# EAGLE board ADC3_FPGA_BGA (EAGLE 9.6.2)
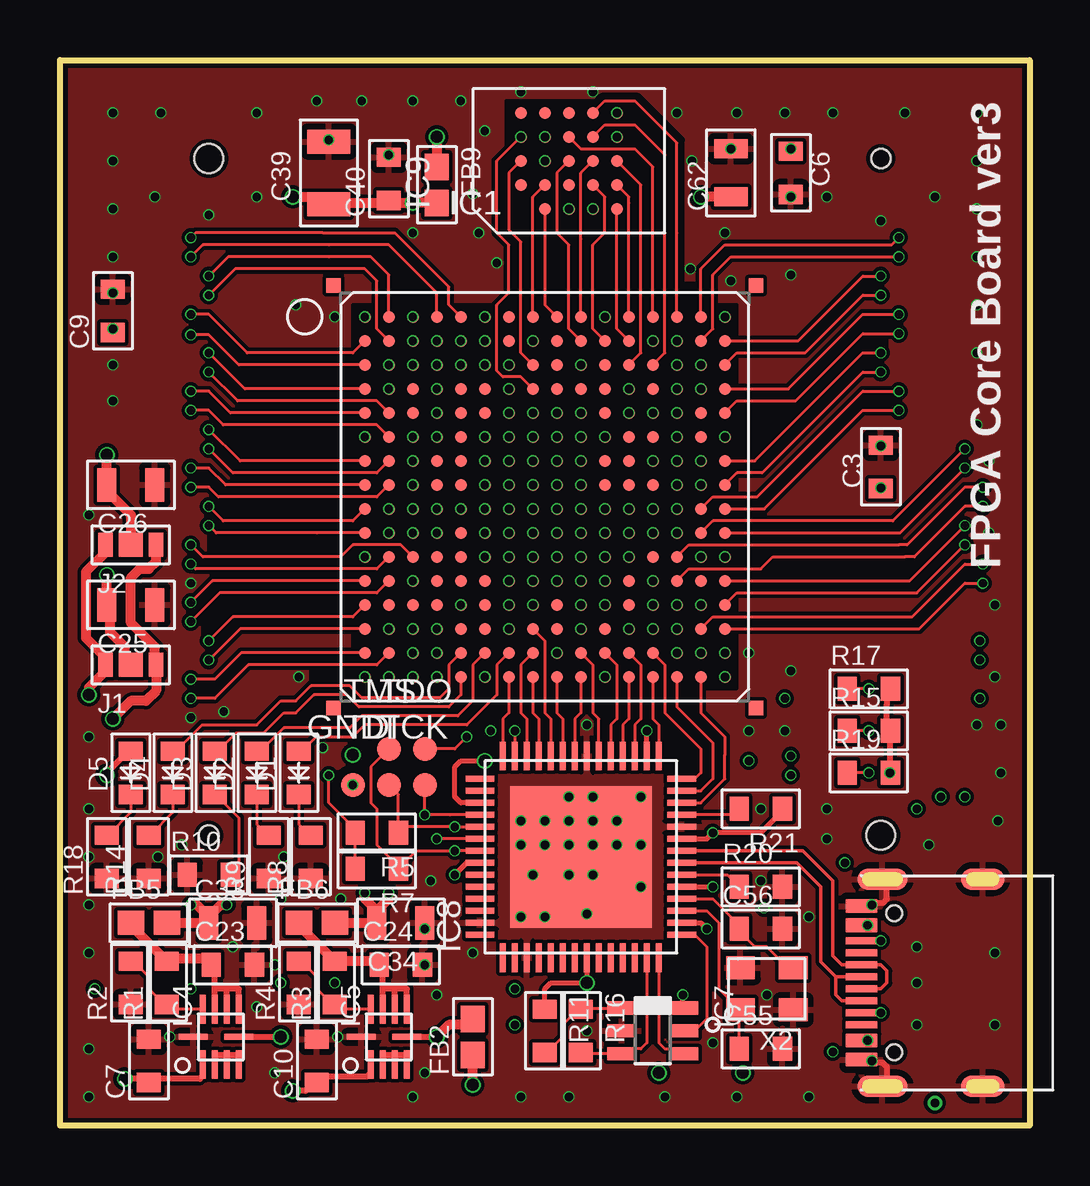
[diagram p2: board, top side]
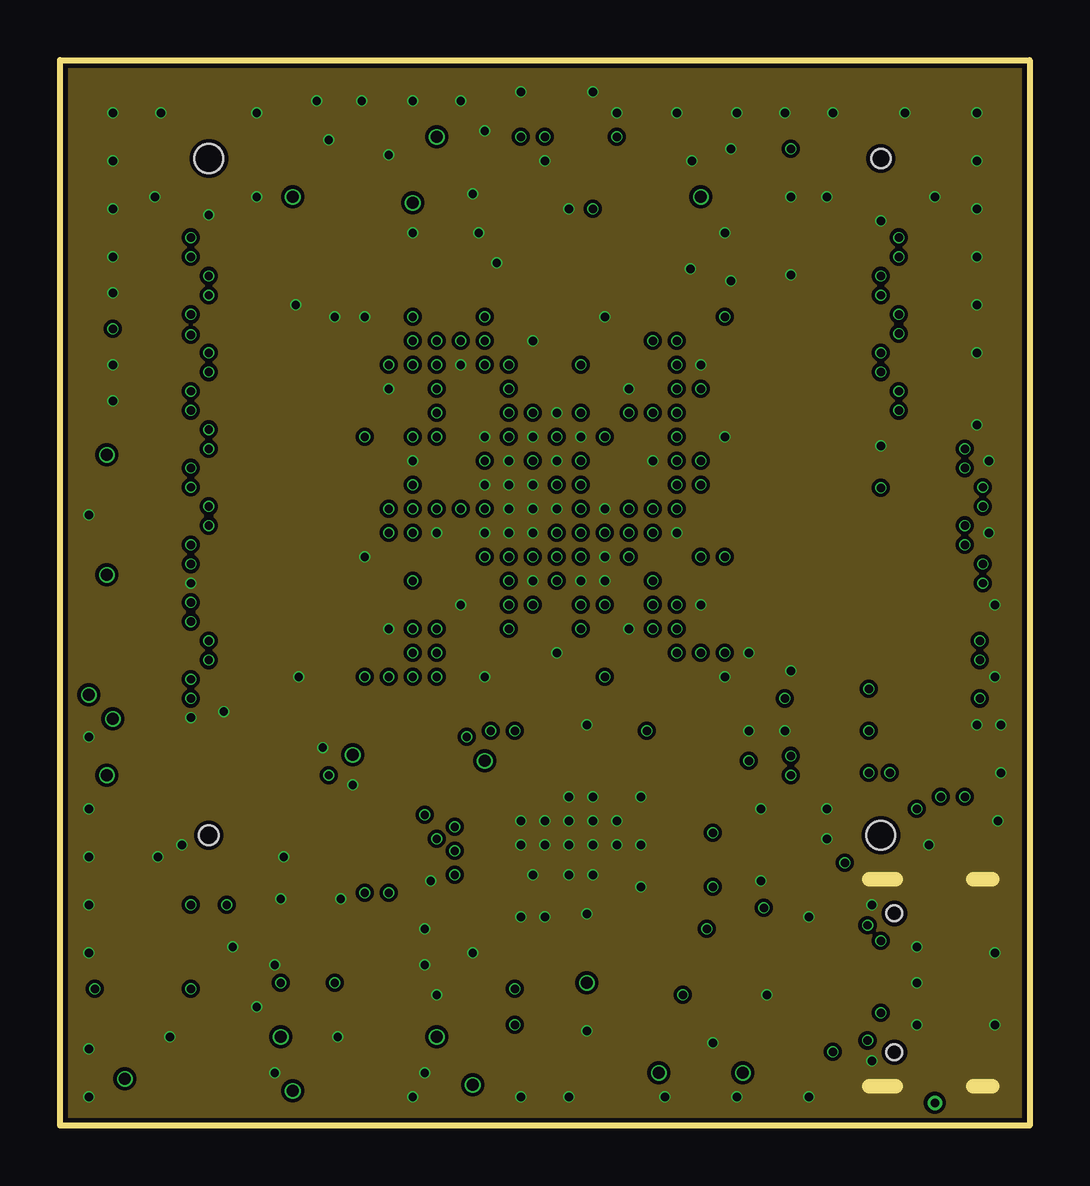
[diagram p3: board, inner layer Route2]
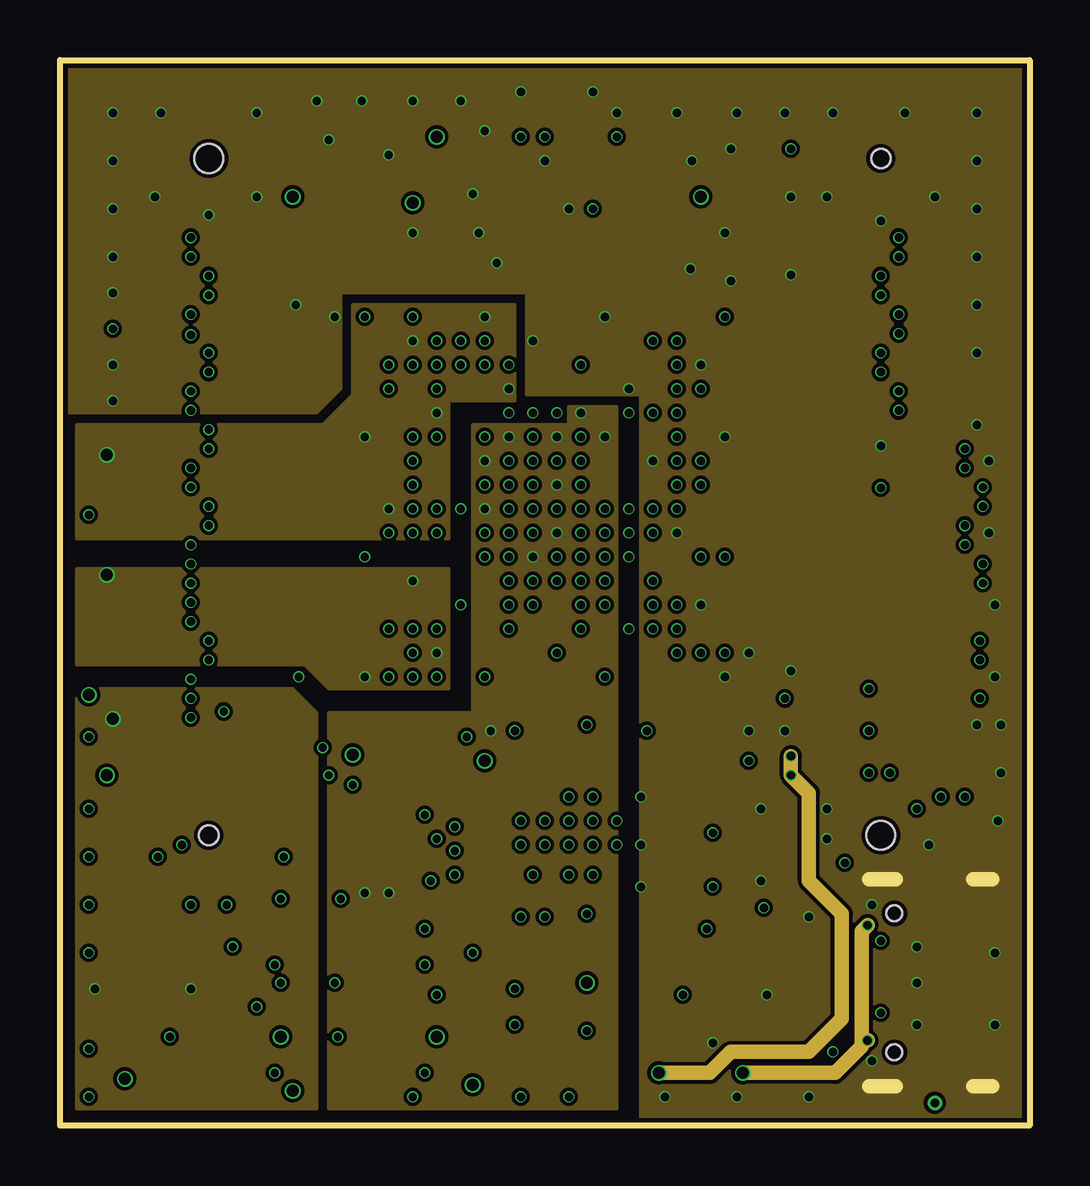
[diagram p4: board, inner layer Route3]
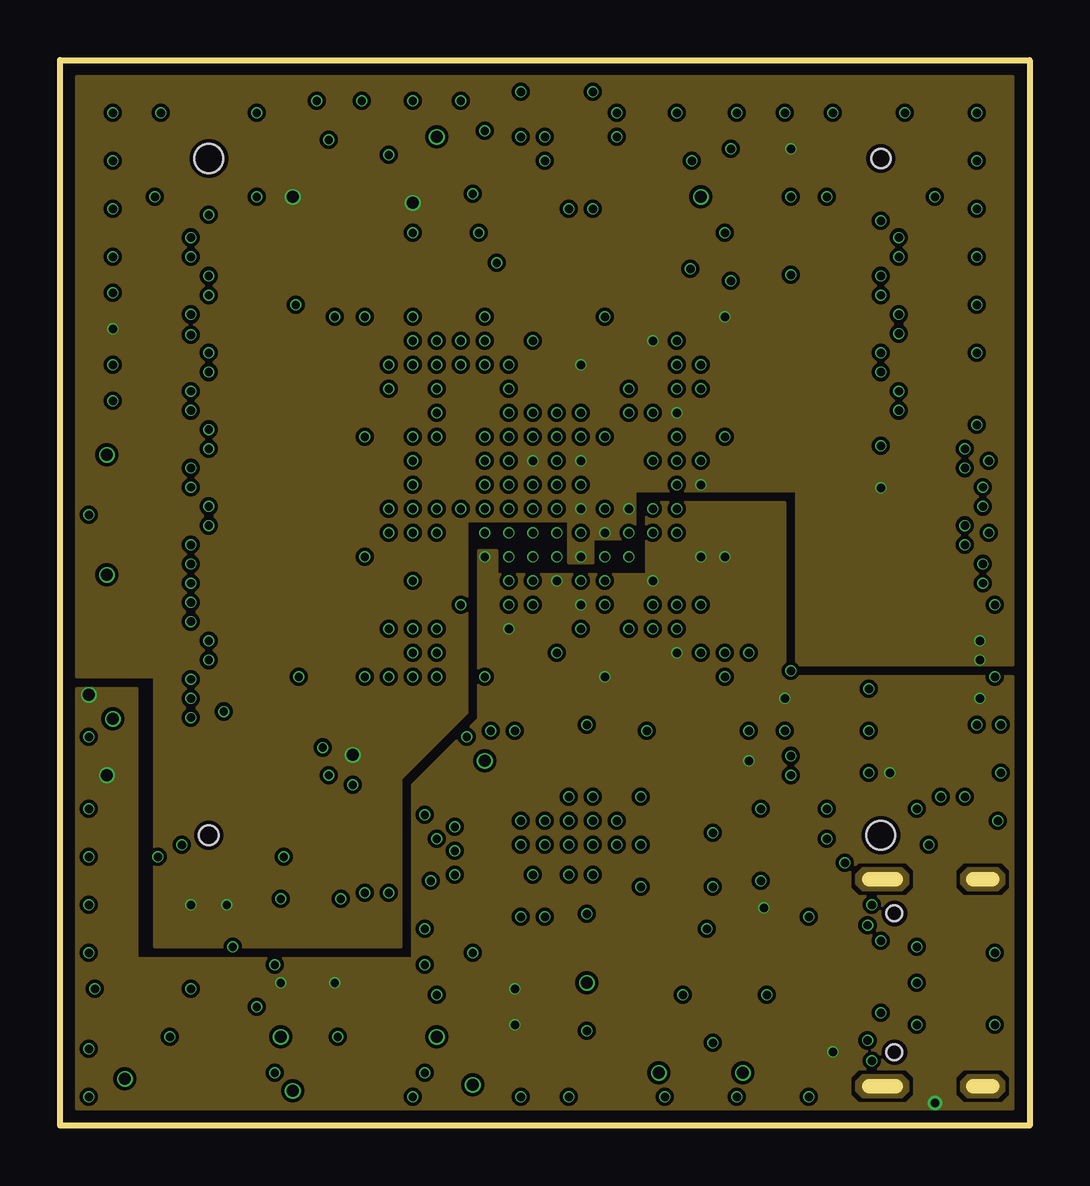
[diagram p5: board, inner layer Route14]
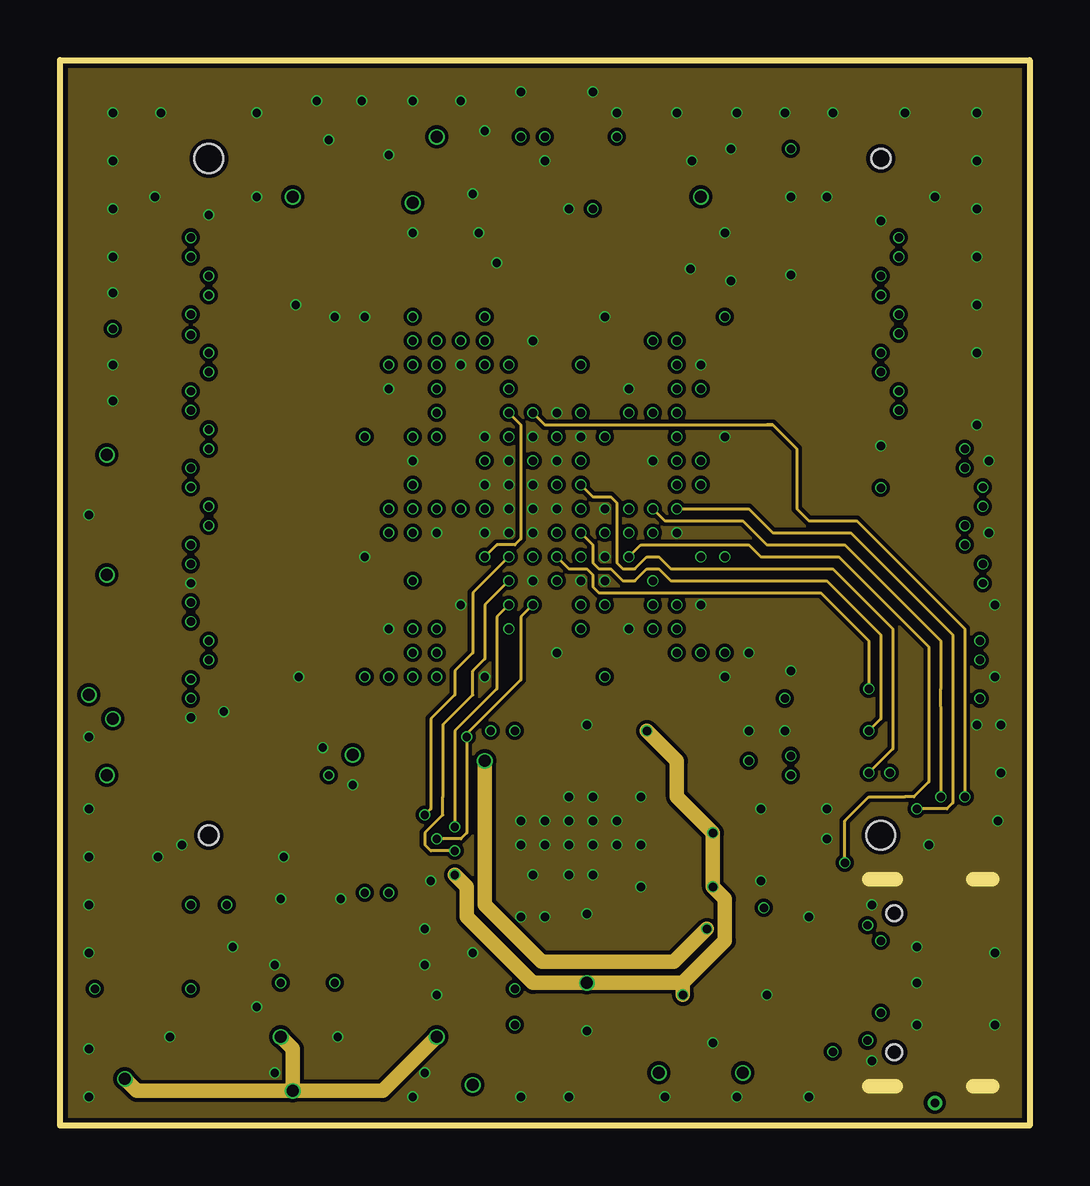
[diagram p6: board, inner layer Route15]
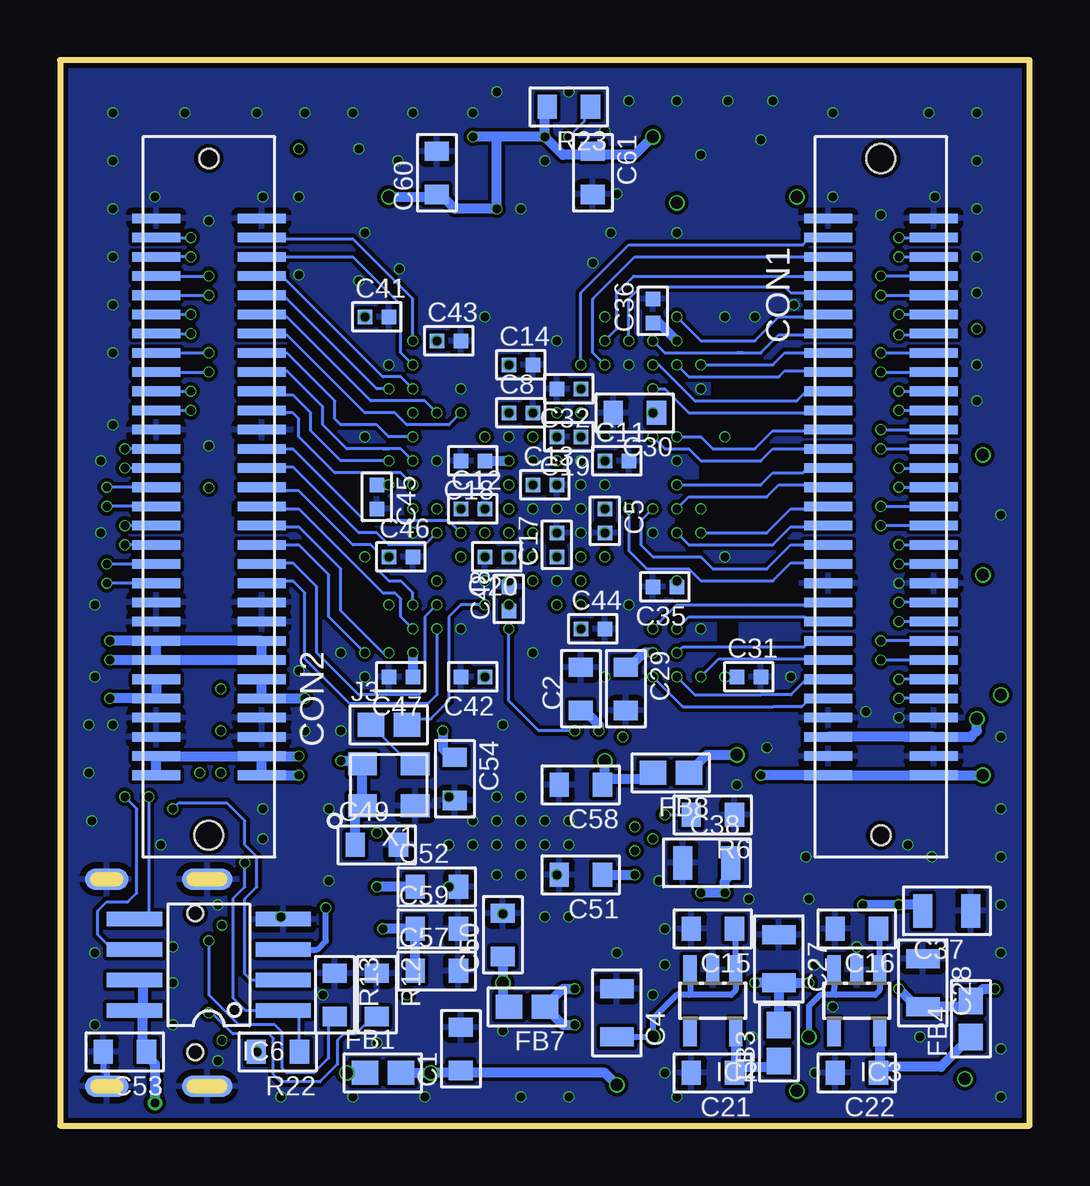
[diagram p7: board, bottom side, seen from below]

Size 40.4 x 44.4 mm. Coordinates in mm from the lower left corner, seen from the top.
Outline: 0,44.4 40.4,44.4 40.4,0 0,0 0,44.4
Copper layers (1+2*3+14*15+16): Top 0.035mm / dielectric 0.2mm / Route2 0.0175mm / dielectric 1.065mm / Route3 0.035mm / dielectric 0.2mm / Route14 0.035mm / dielectric 0.15mm / Route15 0.0175mm / dielectric 0.2mm / Bottom 0.035mm
Design rules "JLCPCB_4layer_limit *": minimum track width 5mil, minimum drill 0.3mm, track to track 5mil, track to pad 5mil, pad to pad 5mil, via to via 5mil, smd to smd 0mil, copper to edge 0.2mm, drill to drill 10mil, minimum pad ring 0.13mm, minimum via ring 0.05mm, stop-mask expansion 2mil, vias tented up to drill 1mm, thermal gap 10mil
tRestrict: area 11.6,13.6 to 12.8,14.8; 5 lines

## Footprints (pad centres in the part's own frame; a part is rotated, then mirrored left to right if it is on the bottom)
1608C = smd 0.8 x 1: 1 -0.9,0; 2 0.9,0
2012 = smd 0.8 x 1.4: 1 -1,0; 2 1,0
1005 = smd 0.6 x 0.6: 1 -0.5,0; 2 0.5,0
3216 = smd 1 x 1.8: 1 -1.3,0; 2 1.3,0
MEZZANINE_0.8MM_2X30 = smd 0.4 x 2: 1 -11.6,-2.2; 2 -11.6,2.2; 3 -10.8,-2.2; 4 -10.8,2.2; 5 -10,-2.2; 6 -10,2.2; 7 -9.2,-2.2; 8 -9.2,2.2; 9 -8.4,-2.2; 10 -8.4,2.2; 11 -7.6,-2.2; 12 -7.6,2.2; 13 -6.8,-2.2; 14 -6.8,2.2; 15 -6,-2.2; 16 -6,2.2; 17 -5.2,-2.2; 18 -5.2,2.2; 19 -4.4,-2.2; 20 -4.4,2.2; 21 -3.6,-2.2; 22 -3.6,2.2; 23 -2.8,-2.2; 24 -2.8,2.2; 25 -2,-2.2; 26 -2,2.2; 27 -1.2,-2.2; 28 -1.2,2.2; 29 -0.4,-2.2; 30 -0.4,2.2; 31 0.4,-2.2; 32 0.4,2.2; 33 1.2,-2.2; 34 1.2,2.2; 35 2,-2.2; 36 2,2.2; 37 2.8,-2.2; 38 2.8,2.2; 39 3.6,-2.2; 40 3.6,2.2; 41 4.4,-2.2; 42 4.4,2.2; 43 5.2,-2.2; 44 5.2,2.2; 45 6,-2.2; 46 6,2.2; 47 6.8,-2.2; 48 6.8,2.2; 49 7.6,-2.2; 50 7.6,2.2; 51 8.4,-2.2; 52 8.4,2.2; 53 9.2,-2.2; 54 9.2,2.2; 55 10,-2.2; 56 10,2.2; 57 10.8,-2.2; 58 10.8,2.2; 59 11.6,-2.2; 60 11.6,2.2 | hole 1.2: -14.1,0 | hole 0.8: 14.1,0
5077CR-16-SMC2-BK-TR = smd 0.6 x 1.34: A1,B12:GND -3.2,0.3; A4,B9:VBUS -2.4,0.3; B1,A12:GND 3.2,0.3; B4,A9:VBUS 2.4,0.3 | smd 0.3 x 1.34: A5:CC1 -1.25,0.3; A6:DP1 -0.25,0.3; A7:DN1 0.25,0.3; A8:SBU1 1.25,0.3; B5:CC2 1.75,0.3; B6:DP2 0.75,0.3; B7:DN2 -0.75,0.3; B8:SBU2 -1.75,0.3 | smd 0.9 x 2.1: SHILED1 -4.32,-0.57; SHILED2 4.32,-0.57 | smd 0.9 x 1.8: SHILED3 -4.32,-4.75; SHILED4 4.32,-4.75 | smd 0.9 x 2.1 bottom: SHILED5 -4.32,-0.57; SHILED7 4.32,-0.57 | smd 0.9 x 1.8 bottom: SHILED6 -4.32,-4.75; SHILED8 4.32,-4.75 | hole 0.65: -2.89,-1.07; 2.89,-1.07
D1608 = smd 0.8 x 1: A 0.9,0; K -0.9,0
1608-J = smd 1.1 x 1: 1 -0.75,0; 2 0.75,0
FTG256 = smd 0.5 x 0.5: A1 -7.5,7.5; A2 -6.5,7.5; A3 -5.5,7.5; A4 -4.5,7.5; A5 -3.5,7.5; A6 -2.5,7.5; A7 -1.5,7.5; A8 -0.5,7.5; A9 0.5,7.5; A10 1.5,7.5; A11 2.5,7.5; A12 3.5,7.5; A13 4.5,7.5; A14 5.5,7.5; A15 6.5,7.5; A16 7.5,7.5; B1 -7.5,6.5; B2 -6.5,6.5; B3 -5.5,6.5; B4 -4.5,6.5; B5 -3.5,6.5; B6 -2.5,6.5; B7 -1.5,6.5; B8 -0.5,6.5; B9 0.5,6.5; B10 1.5,6.5; B11 2.5,6.5; B12 3.5,6.5; B13 4.5,6.5; B14 5.5,6.5; B15 6.5,6.5; B16 7.5,6.5; C1 -7.5,5.5; C2 -6.5,5.5; C3 -5.5,5.5; C4 -4.5,5.5; C5 -3.5,5.5; C6 -2.5,5.5; C7 -1.5,5.5; C8 -0.5,5.5; C9 0.5,5.5; C10 1.5,5.5; C11 2.5,5.5; C12 3.5,5.5; C13 4.5,5.5; C14 5.5,5.5; C15 6.5,5.5; C16 7.5,5.5; D1 -7.5,4.5; D2 -6.5,4.5; D3 -5.5,4.5; D4 -4.5,4.5; D5 -3.5,4.5; D6 -2.5,4.5; D7 -1.5,4.5; D8 -0.5,4.5; D9 0.5,4.5; D10 1.5,4.5; D11 2.5,4.5; D12 3.5,4.5; D13 4.5,4.5; D14 5.5,4.5; D15 6.5,4.5; D16 7.5,4.5; E1 -7.5,3.5; E2 -6.5,3.5; E3 -5.5,3.5; E4 -4.5,3.5; E5 -3.5,3.5; E6 -2.5,3.5; E7 -1.5,3.5; E8 -0.5,3.5; E9 0.5,3.5; E10 1.5,3.5; E11 2.5,3.5; E12 3.5,3.5; E13 4.5,3.5; E14 5.5,3.5; E15 6.5,3.5; E16 7.5,3.5; F1 -7.5,2.5; F2 -6.5,2.5; F3 -5.5,2.5; F4 -4.5,2.5; F5 -3.5,2.5; F6 -2.5,2.5; F7 -1.5,2.5; F8 -0.5,2.5; F9 0.5,2.5; F10 1.5,2.5; F11 2.5,2.5; F12 3.5,2.5; F13 4.5,2.5; F14 5.5,2.5; F15 6.5,2.5; F16 7.5,2.5; G1 -7.5,1.5; G2 -6.5,1.5; G3 -5.5,1.5; G4 -4.5,1.5; G5 -3.5,1.5; G6 -2.5,1.5; G7 -1.5,1.5; G8 -0.5,1.5; G9 0.5,1.5; G10 1.5,1.5; G11 2.5,1.5; G12 3.5,1.5; G13 4.5,1.5; G14 5.5,1.5; G15 6.5,1.5; G16 7.5,1.5; H1 -7.5,0.5; H2 -6.5,0.5; H3 -5.5,0.5; H4 -4.5,0.5; H5 -3.5,0.5; H6 -2.5,0.5; H7 -1.5,0.5; H8 -0.5,0.5; H9 0.5,0.5; H10 1.5,0.5; H11 2.5,0.5; H12 3.5,0.5; H13 4.5,0.5; H14 5.5,0.5; H15 6.5,0.5; H16 7.5,0.5; J1 -7.5,-0.5; J2 -6.5,-0.5; J3 -5.5,-0.5; J4 -4.5,-0.5; J5 -3.5,-0.5; J6 -2.5,-0.5; J7 -1.5,-0.5; J8 -0.5,-0.5; J9 0.5,-0.5; J10 1.5,-0.5; J11 2.5,-0.5; J12 3.5,-0.5; J13 4.5,-0.5; J14 5.5,-0.5; J15 6.5,-0.5; J16 7.5,-0.5; K1 -7.5,-1.5; K2 -6.5,-1.5; K3 -5.5,-1.5; K4 -4.5,-1.5; K5 -3.5,-1.5; K6 -2.5,-1.5; K7 -1.5,-1.5; K8 -0.5,-1.5; K9 0.5,-1.5; K10 1.5,-1.5; K11 2.5,-1.5; K12 3.5,-1.5; K13 4.5,-1.5; K14 5.5,-1.5; K15 6.5,-1.5; K16 7.5,-1.5; L1 -7.5,-2.5; L2 -6.5,-2.5; L3 -5.5,-2.5; L4 -4.5,-2.5; L5 -3.5,-2.5; L6 -2.5,-2.5; L7 -1.5,-2.5; L8 -0.5,-2.5; L9 0.5,-2.5; L10 1.5,-2.5; L11 2.5,-2.5; L12 3.5,-2.5; L13 4.5,-2.5; L14 5.5,-2.5; L15 6.5,-2.5; L16 7.5,-2.5; M1 -7.5,-3.5; M2 -6.5,-3.5; M3 -5.5,-3.5; M4 -4.5,-3.5; M5 -3.5,-3.5; M6 -2.5,-3.5; M7 -1.5,-3.5; M8 -0.5,-3.5; M9 0.5,-3.5; M10 1.5,-3.5; M11 2.5,-3.5; M12 3.5,-3.5; M13 4.5,-3.5; M14 5.5,-3.5; M15 6.5,-3.5; M16 7.5,-3.5; N1 -7.5,-4.5; N2 -6.5,-4.5; N3 -5.5,-4.5; N4 -4.5,-4.5; N5 -3.5,-4.5; N6 -2.5,-4.5; N7 -1.5,-4.5; N8 -0.5,-4.5; N9 0.5,-4.5; N10 1.5,-4.5; N11 2.5,-4.5; N12 3.5,-4.5; N13 4.5,-4.5; N14 5.5,-4.5; N15 6.5,-4.5; N16 7.5,-4.5; P1 -7.5,-5.5; P2 -6.5,-5.5; P3 -5.5,-5.5; P4 -4.5,-5.5; P5 -3.5,-5.5; P6 -2.5,-5.5; P7 -1.5,-5.5; P8 -0.5,-5.5; P9 0.5,-5.5; P10 1.5,-5.5; P11 2.5,-5.5; P12 3.5,-5.5; P13 4.5,-5.5; P14 5.5,-5.5; P15 6.5,-5.5; P16 7.5,-5.5; R1 -7.5,-6.5; R2 -6.5,-6.5; R3 -5.5,-6.5; R4 -4.5,-6.5; R5 -3.5,-6.5; R6 -2.5,-6.5; R7 -1.5,-6.5; R8 -0.5,-6.5; R9 0.5,-6.5; R10 1.5,-6.5; R11 2.5,-6.5; R12 3.5,-6.5; R13 4.5,-6.5; R14 5.5,-6.5; R15 6.5,-6.5; R16 7.5,-6.5; T1 -7.5,-7.5; T2 -6.5,-7.5; T3 -5.5,-7.5; T4 -4.5,-7.5; T5 -3.5,-7.5; T6 -2.5,-7.5; T7 -1.5,-7.5; T8 -0.5,-7.5; T9 0.5,-7.5; T10 1.5,-7.5; T11 2.5,-7.5; T12 3.5,-7.5; T13 4.5,-7.5; T14 5.5,-7.5; T15 6.5,-7.5; T16 7.5,-7.5 | smd 0.6 x 0.6: GUID1 -8.8,8.8; GUID2 -8.8,-8.8; GUID3 8.8,-8.8; GUID4 8.8,8.8
SOT23-5 = smd 0.55 x 1.2: 1 -0.95,-1.3; 2 0,-1.3; 3 0.95,-1.3; 4 0.95,1.3; 5 -0.95,1.3
QFN-10 = smd 1.2 x 0.25: 1 -1.15,0.75; 2 -1.15,0.25; 3 -1.15,-0.25; 4 -1.15,-0.75; 6 1.15,-0.75; 7 1.15,-0.25; 8 1.15,0.25; 9 1.15,0.75 | smd 0.25 x 1.2: 5 0,-0.75; 10 0,1.15
SOIC-SOIJ-8 = smd 0.6 x 2.3: 1 -1.905,-3.1; 2 -0.635,-3.1; 3 0.635,-3.1; 4 1.905,-3.1; 5 1.905,3.1; 6 0.635,3.1; 7 -0.635,3.1; 8 -1.905,3.1
SOT23-6 = smd 0.55 x 1.2: 1 -0.95,-1.3; 2 0,-1.3; 3 0.95,-1.3; 4 0.95,1.3; 5 0,1.3; 6 -0.95,1.3
QFN56-HT = smd 0.25 x 1.2: 1 -3.25,-4.2; 2 -2.75,-4.2; 3 -2.25,-4.2; 4 -1.75,-4.2; 5 -1.25,-4.2; 6 -0.75,-4.2; 7 -0.25,-4.2; 8 0.25,-4.2; 9 0.75,-4.2; 10 1.25,-4.2; 11 1.75,-4.2; 12 2.25,-4.2; 13 2.75,-4.2; 14 3.25,-4.2; 29 3.25,4.2; 30 2.75,4.2; 31 2.25,4.2; 32 1.75,4.2; 33 1.25,4.2; 34 0.75,4.2; 35 0.25,4.2; 36 -0.25,4.2; 37 -0.75,4.2; 38 -1.25,4.2; 39 -1.75,4.2; 40 -2.25,4.2; 41 -2.75,4.2; 42 -3.25,4.2 | smd 1.2 x 0.25: 15 4.2,-3.25; 16 4.2,-2.75; 17 4.2,-2.25; 18 4.2,-1.75; 19 4.2,-1.25; 20 4.2,-0.75; 21 4.2,-0.25; 22 4.2,0.25; 23 4.2,0.75; 24 4.2,1.25; 25 4.2,1.75; 26 4.2,2.25; 27 4.2,2.75; 28 4.2,3.25; 43 -4.2,3.25; 44 -4.2,2.75; 45 -4.2,2.25; 46 -4.2,1.75; 47 -4.2,1.25; 48 -4.2,0.75; 49 -4.2,0.25; 50 -4.2,-0.25; 51 -4.2,-0.75; 52 -4.2,-1.25; 53 -4.2,-1.75; 54 -4.2,-2.25; 55 -4.2,-2.75; 56 -4.2,-3.25 | smd 5.9 x 5.9: HT 0,0
TFBGA24 = smd 0.5 x 0.5: A2 -1,2; A3 0,2; A4 1,2; A5 2,2; B1 -2,1; B2 -1,1; B3 0,1; B4 1,1; B5 2,1; C1 -2,0; C2 -1,0; C3 0,0; C4 1,0; C5 2,0; D1 -2,-1; D2 -1,-1; D3 0,-1; D4 1,-1; D5 2,-1; E1 -2,-2; E2 -1,-2; E3 0,-2; E4 1,-2; E5 2,-2
1608-3-J = smd 0.6 x 1: 1 -1.05,0; 3 1.05,0 | smd 1 x 1: 2 0,0
1608 = smd 0.8 x 1: 1 -0.9,0; 2 0.9,0
TESTPAD-SMALL = smd 1 x 1: 1 0,0
KC3225 = smd 1.2 x 0.95: 1 -1.1,-0.875; 2 1.1,-0.875; 3 1.1,0.875; 4 -1.1,0.875

## Placement (x,y rotation side)
C1  0.1u  [1608C]  23.7,3.2 90 bottom
C2  4.7u  [1608C]  18.7,18.2 90 bottom
C3  4.7u  [1608C]  34.2,27.45 90 top
C4  10u  [2012]  17.2,4.7 90 bottom
C5  1u  [1005]  17.7,25.2 270 bottom
C6  4.7u  [1608C]  30.45,39.7 270 top
C7  10u  [1608C]  3.7,2.7 90 top
C8  1u  [1005]  21.2,29.7 0 bottom
C9  4.7u  [1608C]  2.2,33.95 90 top
C10  10u  [1608C]  10.7,2.7 90 top
C11  1u  [1005]  17.2,27.7 0 bottom
C12  1u  [1005]  23.2,25.7 0 bottom
C13  1u  [1005]  20.2,26.7 0 bottom
C14  1u  [1005]  21.2,31.7 0 bottom
C15  0.1u  [1608C]  13.2,8.2 180 bottom
C16  0.1u  [1608C]  7.2,8.2 180 bottom
C17  1u  [1005]  19.7,24.2 90 bottom
C18  1u  [1005]  23.2,27.7 180 bottom
C19  1u  [1005]  19.2,28.7 180 bottom
C20  1u  [1005]  22.2,23.7 180 bottom
C21  10u  [1608C]  13.2,2.2 180 bottom
C22  10u  [1608C]  7.2,2.2 180 bottom
C23  10u  [1608C]  7.2,6.7 0 top
C24  10u  [1608C]  14.2,6.7 0 top
C25  47u  [2012]  2.95,21.7 0 top
C26  47u  [2012]  2.95,26.7 0 top
C27  47u  [2012]  10.45,6.95 90 bottom
C28  47u  [2012]  4.45,5.95 90 bottom
C29  4.7u  [1608C]  16.82,18.2 270 bottom
C30  4.7u  [1608C]  16.45,29.7 180 bottom
C31  1u  [1005]  11.7,18.7 0 bottom
C32  1u  [1005]  19.2,30.7 180 bottom
C33  47u  [2012]  7.2,8.45 0 top
C34  47u  [2012]  14.2,8.45 0 top
C35  1u  [1005]  15.2,22.45 180 bottom
C36  1u  [1005]  15.7,33.95 90 bottom
C37  47u  [2012]  3.45,8.95 0 bottom
C38  47u  [2012]  13.45,10.95 180 bottom
C39  10u  [3216]  11.2,39.7 90 top
C40  0.1u  [1608C]  13.7,39.45 90 top
C41  1u  [1005]  27.2,33.7 0 bottom
C42  1u  [1005]  23.2,18.7 180 bottom
C43  1u  [1005]  24.2,32.7 0 bottom
C44  1u  [1005]  18.2,20.7 0 bottom
C45  1u  [1005]  27.2,26.2 270 bottom
C46  1u  [1005]  26.2,23.7 0 bottom
C47  1u  [1005]  26.2,18.7 180 bottom
C48  1u  [1005]  21.7,21.95 90 bottom
C49  0.1u  [1608C]  27.2,11.7 0 bottom
C50  10u  [1608C]  21.95,7.95 90 bottom
C51  0.1u  [1608C]  18.7,10.45 180 bottom
C52  0.1u  [1608C]  24.7,9.95 0 bottom
C53  0.1u  [1608C]  37.7,3.08 180 bottom
C54  0.1u  [1608C]  23.95,14.45 270 bottom
C55  22p  [1608C]  29.2,3.2 0 top
C56  22p  [1608C]  29.2,8.2 0 top
C57  10u  [1608C]  24.7,6.45 0 bottom
C58  0.1u  [1608C]  18.7,14.2 180 bottom
C59  0.1u  [1608C]  24.7,8.2 0 bottom
C60  1u  [1608C]  24.7,39.7 90 bottom
C61  1u  [1608C]  18.2,39.7 270 bottom
C62  10u  [2012]  27.95,39.7 90 top
CON1  MEZZANINE_2X30  [MEZZANINE_0.8MM_2X30]  6.2,26.2 270 bottom
CON2  MEZZANINE_2X30  [MEZZANINE_0.8MM_2X30]  34.2,26.2 90 bottom
CON3  USB-C  [5077CR-16-SMC2-BK-TR]  33.7,5.95 90 top
D1  0  [D1608]  9.95,14.7 90 top
D2  1  [D1608]  8.2,14.7 90 top
D3  2  [D1608]  6.45,14.7 90 top
D4  3  [D1608]  4.7,14.7 90 top
D5  P  [D1608]  2.95,14.7 90 top
FB1  USB  [1608-J]  26.95,2.2 0 bottom
FB2  VIN  [1608-J]  17.2,3.7 90 top
FB3  3.3V  [1608-J]  10.45,3.45 90 bottom
FB4  2.5V  [1608-J]  2.45,4.45 90 bottom
FB5  1.8V  [1608-J]  3.7,8.45 0 top
FB6  1.0V  [1608-J]  10.7,8.45 0 top
FB7  FT  [1608-J]  20.95,4.95 180 bottom
FB8  FT  [1608-J]  14.95,14.7 180 bottom
FB9  DRAM  [1608-J]  15.7,39.2 270 top
IC1  ARTIX7-FTG256  [FTG256]  20.2,26.2 0 top
IC2  3.3V  [SOT23-5]  13.2,5.2 180 bottom
IC3  2.5V  [SOT23-5]  7.2,5.2 180 bottom
IC4  MPM3811  [QFN-10]  6.7,3.7 90 top
IC5  MPM3804  [QFN-10]  13.7,3.7 90 top
IC6  EEPROM  [SOIC-SOIJ-8]  34.2,6.7 90 bottom
IC7  93LC56  [SOT23-6]  24.7,3.95 270 top
IC8  FT2232H  [QFN56-HT]  21.7,11.2 90 top
IC9  HyperRAM  [TFBGA24]  21.2,40.2 90 top
J1  BANK34  [1608-3-J]  2.95,19.2 0 top
J2  BANK35  [1608-3-J]  2.95,24.2 0 top
J3  25M  [1608-J]  26.7,16.7 0 bottom
R1  10k  [1608]  4.45,5.95 90 top
R2  5k  [1608]  2.95,5.95 90 top
R3  1k  [1608]  11.45,5.95 90 top
R4  1.5k  [1608]  9.95,5.95 90 top
R5  10k  [1608]  13.2,12.2 180 top
R6  10k  [1608]  13.2,12.95 180 bottom
R7  10k  [1608]  13.2,10.7 180 top
R8  1k  [1608]  10.45,11.2 90 top
R9  1k  [1608]  8.7,11.2 90 top
R10  1k  [1608]  6.2,10.45 0 top
R11  10k  [1608]  20.2,3.95 270 top
R12  5.1k  [1608]  27.2,5.45 270 bottom
R13  5.1k  [1608]  28.95,5.45 270 bottom
R14  1k  [1608]  3.7,11.2 90 top
R15  10k  [1608]  33.7,16.45 0 top
R16  1k  [1608]  21.7,3.95 270 top
R17  10k  [1608]  33.7,18.2 0 top
R18  1k  [1608]  1.95,11.2 90 top
R19  10k  [1608]  33.7,14.7 0 top
R20  12.1k  [1608]  29.2,9.95 0 top
R21  1k  [1608]  29.2,13.2 180 top
R22  10k  [1608]  31.32,3.08 180 bottom
R23  1k  [1608]  19.2,42.45 180 bottom
TP1  TMS  [TESTPAD-SMALL]  13.7,15.7 0 top
TP2  TDI  [TESTPAD-SMALL]  13.7,14.2 0 top
TP3  TCK  [TESTPAD-SMALL]  15.2,14.2 0 top
TP4  TDO  [TESTPAD-SMALL]  15.2,15.7 0 top
TP5  GND  [TESTPAD-SMALL]  12.2,14.2 0 top
X1  OSC  [KC3225]  26.7,14.2 0 bottom
X2  12MHz  [KC3225]  29.45,5.7 0 top

## Tracks (layer width: path | path; a pad name or v marks a point on that pad's centre or on a via)
1.0V_DCDC_SW
  Top 0.254: IC5.2 13.45,2.95 13.95,2.95 | 13.95,2.95 14.45,2.95 IC5.4 | IC5.3 13.95,2.95
1.8V_DCDC_SW
  Top 0.254: IC4.2 6.45,2.95 6.95,2.95 | 6.95,2.95 7.45,2.95 IC4.4 | IC4.3 6.95,2.95
+1V0  (via drill 0.35)
  Top 0.254: C34.1 13.2,8.7 13.2,8.95
  Top 0.406: FB6.2 C34.1 13.2,8.95 | 13.2,8.95 12.7,9.45 v12.7,9.7 | v13.7,9.7 13.7,9.45 13.2,8.95
  Bottom 0.406: C38.1 12.45,10.45 12.7,10.2 v12.7,9.7 v13.7,9.7 | C2.1 18.55,17.3 17.95,16.7 v17.95,16.45
  other vias: 21.7,29.7 18.7,28.7 20.7,28.7 22.7,28.7 20.7,26.7 17.7,27.7 17.7,25.7 20.7,24.7 19.7,23.7
  pour Route3 (isolate 0.152): 23.2,29.95 21.2,29.95 21.2,29.2 17.2,29.2 17.2,17.2 11.2,17.2 11.2,0.7 23.2,0.7
+1V0_DCDC
  Top 0.254: IC5.8 13.45,5.7 | 13.45,5.7 13.45,6.55 C24.1 | IC5.6 14.45,5.7 13.95,5.7 | 13.95,5.7 13.45,5.7 | IC5.7 13.95,5.7
  Top 0.406: C24.1 13.15,6.85 R3.2 9.95,8.35 FB6.1
+1V0_DCDC_FB
  Top 0.127: IC5.9 11.65,4.85 R3.1 11.35,5.05 10.7,5.7 10.7,6.2 10.05,6.85 R4.2
+1V8  (via drill 0.35, 0.5)
  Top 0.254: C33.1 6.2,8.7
  Top 0.406: FB9.2 v14.7,38.45 14.2,38.45 | 13.7,38.45 11.25,38.45 C39.1 10.7,38.4 10.4,38.7 v9.7,38.7 | 13.7,38.45 13.95,38.45 14.2,38.45 | 13.7,38.45 14.2,38.45 | C40.1 13.7,38.45 | FB5.2 C33.1 | v5.45,9.2 5.7,9.2 6.2,8.7 6.7,9.2 v6.95,9.2 | C6.1 v30.45,40.7 | C3.1 v34.2,26.57 | v2.2,33.2 C9.1
  Bottom 0.406: FB8.1 13.45,15.45 v12.2,15.45 | CON2.16 CON2.15 CON2.13 CON2.14 | CON2.14 CON2.16 | CON2.16 v38.33,20.2 | CON2.14 38.15,19.4 v38.33,19.4 | v6.95,9.2 v5.45,9.2 4.7,9.2 C37.1 | C18.1 IC1.G10 | C45.1 IC1.H15
  other vias: 27.7,33.7 21.7,31.7 21.7,27.7 19.7,27.7 24.7,32.7 25.7,29.7 21.7,25.7 23.7,25.7 22.7,24.7 21.7,23.7 26.7,26.7
  pour Route14 (isolate 0.152): 39.7,26.45 23.95,26.45 23.95,24.45 22.2,24.45 22.2,23.45 21.2,23.45 21.2,25.2 16.95,25.2 16.95,17.2 14.2,14.45 14.2,7.45 3.95,7.45 3.95,17.2 7.2,17.2 10.2,20.2 12.2,20.2 12.2,43.7 39.7,43.7
  pour Route14 (isolate 0.152): 3.95,17.2 3.95,18.7 0.7,18.7 0.7,43.7 16.2,43.7 16.2,17.2
  pour Route14 (isolate 0.152): 39.7,26.45 39.7,19.2 30.7,19.2 30.7,26.45
+1V8_DCDC
  Top 0.254: C23.1 6.45,6.55 6.45,5.7 | 6.95,5.7 7.45,5.7 IC4.6 | 6.95,5.7 6.45,5.7 | IC4.8 6.45,5.7 | IC4.7 6.95,5.7 | 4.45,6.95 R1.2
  Top 0.406: C23.1 6.05,6.95 4.45,6.95 | R1.2 2.95,8.35 FB5.1
+1V8_DCDC_FB
  Top 0.127: R2.2 3.05,6.85 3.7,6.2 3.7,5.7 4.35,5.05 R1.1 4.65,4.85 IC4.9
+2V5  (via drill 0.35, 0.5)
  Top 0.406: v2.2,16.95 2.95,17.7 3.58,17.7 4,18.12 J1.3 3.95,19.25 3.95,19.95 2.95,20.95 2.95,22.82 3.33,23.2 3.7,23.2 4,23.5 J2.3
  Bottom 0.406: CON1.56 5.2,16.2 | 5.2,16.2 CON1.55 | 5.2,16.2 2.45,16.2 2.2,16.45 v2.2,16.95 | v1.45,5.7 1.95,5.7 FB4.2 2.7,4.95 C28.1 4.7,4.95 v5.45,5.7
  pour Route3 (isolate 0.152): 0.7,18.2 0.7,0.7 10.7,0.7 10.7,17.2 9.7,18.2
+2V5_LDO
  Bottom 0.406: 6.25,2.25 C22.1 | C22.1 6.05,2.45 3.7,2.45 FB4.1 | IC3.5 6.25,2.25 | 6.25,2.25 C22.1
+3V3  (via drill 0.35, 0.35 pad 0.6, 0.5)
  Top 0.127: R7.2 R5.2 12.3,12.35 11.2,13.45 v11.2,14.6
  Top 0.254: R17.2 34.45,18.05 34.45,17.55 34.45,16.6 R15.2 R19.2 v34.58,14.7 | v1.95,14.6 1.95,14.7 2.85,15.6 D5.A
  Top 0.406: v1.2,17.95 1.2,18.25 1.9,18.95 J1.1 1.9,19.5 1.07,20.32 1.07,23.07 1.9,23.9 J2.1
  Route15 0.127: IC1.E7 19.2,29.2 19.2,24.45 18.95,24.2 18.2,24.2 IC1.L6
  Bottom 0.203: C48.1 IC1.N10
  Bottom 0.254: R22.2 v32.2,3.08 | IC6.3 29.69,7.33 29.32,7.7 v29.32,9.07
  Bottom 0.406: v1.95,14.6 CON1.60 CON1.59 v11.2,14.6 | CON2.11 CON2.9 v30.2,17.8 | CON2.12 CON2.10 v38.33,17.8 | C27.1 v9.2,5.95 | C27.1 v11.45,5.95 | C27.1 FB3.2 | v18.95,5.7 19.45,5.7 FB7.1 19.45,4.2 v18.95,4.2 | v36.45,0.95 36.45,2.58 36.83,2.95 36.83,3.05 C53.1 36.95,3.23 36.95,4.79 | 36.95,4.79 IC6.8 | IC6.7 36.95,6.07 36.95,4.79 | C49.1 28.1,13.02 X1.1 X1.4 27.93,15.2 v28.7,15.2 | IC1.R14 C47.1
  other vias: 17.7,23.7 27.7,23.7 24.7,22.7 21.7,21.7 25.7,19.7 22.7,18.7 18.7,20.7 20.7,22.7 26.7,23.7 18.7,29.7
  pour Route14 (isolate 0.152, rank 2): 39.7,18.7 30.2,18.7 30.2,25.95 24.45,25.95 24.45,22.95 18.2,22.95 18.2,23.95 17.45,23.95 17.45,16.95 14.7,14.2 14.7,6.95 2.2,6.95 2.2,0.7 39.7,0.7
  pour Route14 (isolate 0.152): 3.2,0.7 0.7,0.7 0.7,18.2 3.2,18.2
+3V3_LDO
  Bottom 0.254: C21.1 12.25,2.25
  Bottom 0.406: FB3.1 10.7,2.45 12.05,2.45 C21.1 12.25,2.25 IC2.5
CLK_25M  (via drill 0.35)
  Bottom 0.127: IC1.N11 23.7,21.7 24.2,21.2 24.2,17.7 24.95,16.95 25.7,16.95 J3.2
  other vias: 22.7,21.7
DONE  (via drill 0.35)
  Top 0.127: v33.7,14.7 R19.1
  Route15 0.127: IC1.H10 22.2,26.2 22.95,26.2 23.2,25.95 23.2,23.45 23.45,23.2 23.95,23.2 24.45,23.7 24.95,23.7 25.45,23.2 32.2,23.2 34.7,20.7 34.7,15.7 v33.7,14.7
  other vias: 21.7,26.7
DRAM_+1V8  (via drill 0.35, 0.5)
  Top 0.406: v15.7,41.2 FB9.1 | C62.1 v26.7,38.7
  Bottom 0.406: IC9.B4 20.2,42.35 R23.2 | IC9.B4 19.45,40.45 18.35,40.45 C61.1 18.07,40.48 16.43,40.48 v15.7,41.2 | IC9.B4 22.2,41.2 | 22.2,41.2 IC9.E4 | 22.2,41.2 IC9.D1 23.95,38.2 24.55,38.8 C60.1 24.7,38.7 v26.7,38.7
  other vias: 20.2,41.2 23.2,41.2 22.2,38.2
DRAM_CKN
  Top 0.127: IC9.B1 20.2,34.2 IC1.A9
DRAM_CKP
  Top 0.127: IC9.B2 19.7,38.7 IC1.A8
DRAM_CS
  Top 0.127: IC9.A3 18.7,39.7 18.7,37.33 19.2,36.83 19.2,32.2 IC1.C8
DRAM_DQ0
  Top 0.127: IC9.D3 21.7,39.7 21.7,36.95 IC1.A10
DRAM_DQ1
  Top 0.127: IC9.D2 22.7,38.7 22.7,37.2 22.2,36.7 22.2,33.2 IC1.B11
DRAM_DQ2
  Top 0.127: IC9.C4 21.7,40.7 23.95,40.7 24.7,39.95 24.7,37.2 IC1.A13
DRAM_DQ3
  Top 0.127: IC9.D4 22.7,41.7 23.95,41.7 25.2,40.45 25.2,37.2 25.2,32.2 IC1.C13
DRAM_DQ4
  Top 0.127: IC9.D5 22.7,42.7 23.95,42.7 25.7,40.95 25.7,37.2 IC1.A14
DRAM_DQ5
  Top 0.127: IC9.E3 24.2,39.2 24.2,37.2 24.2,32.2 IC1.C12
DRAM_DQ6
  Top 0.127: IC9.E2 23.7,38.7 23.7,38.45 IC1.A12
DRAM_DQ7
  Top 0.127: IC9.E1 23.2,37.2 23.2,33.2 IC1.B12
DRAM_NRST  (via drill 0.35)
  Top 0.127: IC1.D8 19.2,31.2 18.45,31.2 18.2,31.45 18.2,34.2 18.7,34.7 18.7,36.7 18.2,37.2 18.2,40.2 IC9.A4
  Bottom 0.127: R23.1 18.55,42.2 18.55,41.85 IC9.A4
  other vias: 19.2,41.2
DRAM_RWDS
  Top 0.127: IC9.C3 20.7,39.7 20.7,37.2 21.2,36.7 21.2,33.2 IC1.B10
FLASH_CS  (via drill 0.35)
  Route15 0.127: IC1.L12 24.2,24.2 28.7,24.2 29.2,23.7 32.45,23.7 36.2,19.95 36.2,14.32 35.58,13.7 35.2,13.7 33.7,13.7 32.7,12.7 v32.7,10.95
  Bottom 0.127: v32.7,10.95 32.7,9.95 33.2,9.45 33.2,5.33 32.67,4.79 IC6.1 31.07,4.83 30.43,4.83 R22.1
  other vias: 23.7,23.7
FLASH_MISO  (via drill 0.35)
  Route15 0.127: IC1.J14 28.7,25.7 29.7,24.7 32.95,24.7 37.2,20.45 37.2,13.45 36.95,13.2 v35.7,13.2
  Bottom 0.127: IC6.2 32.44,6.07 32.7,6.33 32.7,9.45 32.2,9.95 32.2,11.2 32.7,11.7 32.7,12.7 33.45,13.45 35.45,13.45 v35.7,13.2
  other vias: 25.7,25.7
FLASH_MOSI  (via drill 0.35)
  Route15 0.127: IC1.J13 25.2,25.2 28.45,25.2 29.45,24.2 32.7,24.2 36.7,20.2 36.7,18.2 36.7,17.45 v36.7,13.7
  Bottom 0.127: IC6.5 36.7,8.6 v36.7,13.7
  other vias: 24.7,25.7
FLASH_SCK  (via drill 0.35)
  Route15 0.127: IC1.E8 20.2,29.2 29.45,29.2 | 29.45,29.2 29.7,29.2 | 29.7,29.2 29.45,29.2 | 29.7,29.2 30.7,28.2 30.7,25.7 31.2,25.2 33.2,25.2 37.7,20.7 v37.7,13.7
  Bottom 0.127: IC6.6 38.21,7.33 38.83,7.95 38.83,8.95 38.45,9.32 37.58,9.32 37.2,9.7 37.2,13.2 v37.7,13.7
  other vias: 19.7,29.7
FT_+1V8  (via drill 0.35, 0.5)
  Top 0.203: IC8.2 26.7,8.45 v26.95,8.2 | IC8.31 16.7,13.45 16.45,13.7 16.45,14.95 16.7,15.2 v17.7,15.2
  Route15 0.61: v17.7,15.2 17.7,9.2 20.07,6.83 25.57,6.83 v26.95,8.2
  Bottom 0.406: C59.1 25.7,8.2 | 25.7,8.2 v26.95,8.2 | C57.1 25.6,8.1 25.7,8.2 | v17.7,15.2 17.7,14.3 C58.1 17.55,14.45 15.95,14.45 FB8.2
FT_+3V3  (via drill 0.35, 0.5)
  Top 0.203: IC8.36 16.95,10.95 v16.45,10.45 | IC8.16 v24.45,16.45 | IC8.50 v21.95,5.95 20.45,5.95 20.2,5.7 R11.1 | IC7.6 25.95,4.95 v25.95,5.45 | IC8.5 v27.2,9.95 | IC8.9 26.95,11.95 v27.2,12.2 29.2,12.2 30.1,13.1 R21.1
  Route15 0.61: v16.45,10.45 16.95,9.95 16.95,8.7 19.7,5.95 v21.95,5.95 25.95,5.95 | v25.95,5.45 25.95,5.95 | 25.95,5.95 27.7,7.7 27.7,9.45 v27.2,9.95 v27.2,12.2 25.7,13.7 25.7,15.2 v24.45,16.45
  Bottom 0.406: C51.1 v16.45,10.45 | v24.45,16.45 24.45,15.7 24.1,15.35 C54.1 | C52.1 v27.2,9.95 | C50.1 v21.95,5.95 21.95,5.2 FB7.2
FT_CLK  (via drill 0.35)
  Top 0.127: v18.95,16.45 IC8.27
  Bottom 0.127: v18.95,16.45 20.45,16.45 21.7,17.7 IC1.P10
  other vias: 21.7,20.7
FT_D0
  Top 0.127: IC8.12 26.7,13.45 27.7,14.45 27.7,15.45 27.7,16.2 26.7,17.2 IC1.T15
FT_D1
  Top 0.127: IC8.13 26.7,13.95 27.2,14.45 27.2,15.95 25.95,17.2 25.7,17.45 IC1.T14
FT_D2
  Top 0.127: IC8.14 26.45,14.45 26.7,14.7 26.7,15.7 25.7,16.7 25.2,17.2 25.2,19.2 IC1.R13
FT_D3
  Top 0.127: IC8.15 24.95,16.7 24.7,16.95 IC1.T13
FT_D4
  Top 0.127: IC8.17 23.95,16.7 24.2,16.95 24.2,19.2 IC1.R12
FT_D5
  Top 0.127: IC8.18 23.45,16.7 23.7,16.95 IC1.T12
FT_D6
  Top 0.127: IC8.19 22.95,16.7 23.2,16.95 23.2,19.2 IC1.R11
FT_D7
  Top 0.127: IC8.20 22.45,16.95 22.2,17.2 22.2,19.2 IC1.R10
FT_NOE
  Top 0.127: IC1.T7 18.7,17.2 18.45,16.95 IC8.28
FT_NRD
  Top 0.127: IC1.P8 20.2,20.2 20.2,17.2 20.45,16.95 IC8.24
FT_NWR
  Top 0.127: IC1.T8 19.7,17.2 19.95,16.95 IC8.25
FT_RXNF
  Top 0.127: IC1.T10 21.7,17.2 21.45,16.95 IC8.22
FT_SIWU
  Top 0.127: IC1.R8 19.2,19.2 19.2,17.2 19.45,16.95 IC8.26
FT_TXNE
  Top 0.127: IC1.T9 20.7,17.2 20.95,16.95 IC8.23
GND  (via drill 0.35)
  Top 0.254: CON3.B1,A12:GND 33.53,9.27 34.28,9.27 34.45,9.45 34.45,10.09 CON3.SHILED2 | CON3.A1,B12:GND 33.53,2.62 34.28,2.62 34.45,2.45 34.45,1.81 CON3.SHILED5
  Top 0.406: CON3.A1,B12:GND 33.78,2.75 v33.83,2.7
  Bottom 0.254: C53.2 38.6,2.35 38.45,2.2 CON3.SHILED6
  other vias: 12.7,33.7 26.7,31.7 23.7,30.7 20.7,29.7 16.7,31.7 13.7,30.7 17.7,28.7 19.7,28.7 21.7,28.7 20.7,27.7 18.7,27.7 19.7,32.7 27.7,28.7 14.7,27.7 24.7,27.7 17.7,26.7 20.7,25.7 22.7,25.7 15.7,24.7 17.7,24.7 25.7,24.7 12.7,23.7 22.7,23.7 19.7,22.7 16.7,21.7 26.7,21.7 13.7,20.7 23.7,20.7 20.7,19.7 17.7,18.7 27.7,18.7 22.7,33.7 18.7,26.7 19.7,26.7 18.7,25.7 19.7,25.7 19.7,24.7 18.7,24.7 21.7,22.7 22.7,22.7 20.2,40.2 23.2,42.2 21.2,38.2 9.95,18.7 21.95,3.95 11.57,3.7 15.7,5.45 8.95,6.7 4.58,3.7 2.2,42.2 2.2,40.2 2.2,38.2 2.2,36.2 2.2,34.7 2.2,31.7 2.2,30.2 1.2,25.45 1.2,16.2 1.2,13.2 1.2,11.2 1.2,9.2 1.2,7.2 1.2,3.2 1.2,1.2 7.2,7.45 15.2,8.2 8.95,2.2 15.2,2.2 15.45,10.2 9.32,11.2 5.08,11.7 4.08,11.2 22.2,11.7 21.2,11.7 20.2,11.7 23.2,11.7 24.2,11.7 19.2,11.7 19.2,12.7 20.2,12.7 21.2,12.7 22.2,12.7 23.2,12.7 24.2,13.7 22.2,13.7 21.2,13.7 21.2,10.45 22.2,10.45 20.2,8.7 19.2,8.7 17.2,7.2 9.2,9.45 4.2,42.2 8.2,42.2 14.7,42.7 11.2,41.08 13.7,40.45 16.7,42.7 38.2,42.2 35.2,42.2 32.2,42.2 30.2,42.2 28.2,42.2 25.7,42.2 26.32,40.2 28.7,19.7 26.26,35.7 18.2,35.95 38.2,40.2 38.2,38.2 38.2,36.2 38.2,34.2 38.2,32.2 38.7,27.7 38.7,24.7 38.95,21.7 38.95,18.7 38.2,16.7 39.2,16.7 30.2,16.45 39.2,14.7 31.95,13.2 31.95,11.95 28.2,1.2 25.2,1.2 19.2,1.2 21.2,1.2 11.45,33.7 3.95,38.7 8.2,38.7 5.45,22.6 31.95,38.7 36.45,38.7 34.2,37.7 6.2,37.95 38.2,29.2 8.2,4.95 29.2,10.2 35.7,5.95 35.7,7.45 38.95,7.2 29.45,5.45 31.2,1.2 33.83,9.2 39.08,12.7 31.2,8.7 12.2,14.2 27.2,3.45 36.2,11.7 38.95,4.2 30.45,18.95 34.2,28.32 27.95,35.2 30.45,35.45 21.95,16.7 5.45,17 10.95,15.75 35.7,4.2 14.7,1.2 11.7,9.45 15.2,6.7 6.83,17.25 12.57,42.7 10.7,42.7 19.2,43.08 28.7,16.45 29.2,13.2 24.2,9.95 21.95,8.82 19.7,10.45 17.2,38.83 17.45,37.2 27.7,37.2 30.45,38.7 27.95,40.7 9.82,34.2 22.2,43.08 14.7,37.2 17.7,41.45
  cutout Top: 23.4,42.7 18.6,42.7 18.6,38.7 19.4,37.9 23.4,37.9
  pour Route15 (isolate 0.152): 0.2,44.2 0.2,0.2 40.2,0.2 40.2,44.2
  pour Top (isolate 0.152): 0.2,0.2 0.2,44.2 40.2,44.2 40.2,0.2
  pour Bottom (isolate 0.152, rank 4): 0.2,0.2 0.2,44.2 40.2,44.2 40.2,0.2
  pour Route2 (isolate 0.152): 0.2,44.2 40.2,44.2 40.2,0.2 0.2,0.2
  pour Top (isolate 0.254, no thermals): 17.95,7.45 17.95,14.95 25.45,14.95 25.45,7.45
  pour Route3 (isolate 0.152): 24.2,0.2 24.2,30.45 19.45,30.45 19.45,34.7 11.7,34.7 11.7,30.7 10.7,29.7 0.2,29.7 0.2,44.2 40.2,44.2 40.2,0.2
  cutout Top: 12.2,34.2 28.2,34.2 28.2,18.2 12.2,18.2
  cutout Top: 34.45,32.95 34.45,32.45 33.95,32.45 33.95,32.95
  cutout Top: 6.7,24.7 6.7,23.95 6.2,23.95 6.2,24.7
  cutout Top: 6.45,21.2 6.45,20.45 5.95,20.45 5.95,21.2
  cutout Top: 10.95,18.95 10.95,18.45 10.45,18.45 10.45,18.95
  cutout Bottom: 12.95,20.95 12.95,20.2 12.2,20.2 12.2,20.95
  cutout Bottom: 10.45,22.95 10.45,22.2 9.7,22.2 9.7,22.95
  cutout Bottom: 14.7,25.7 14.7,24.95 13.95,24.95 13.95,25.7
  cutout Bottom: 13.7,27.7 13.7,26.95 12.95,26.95 12.95,27.7
  cutout Bottom: 14.2,29.45 14.2,28.7 13.45,28.7 13.45,29.45
  cutout Bottom: 13.2,30.95 13.2,30.2 12.45,30.2 12.45,30.95
  cutout Bottom: 26.95,21.95 26.95,21.45 26.45,21.45 26.45,21.95
  cutout Bottom (isolate 0.152): 17.45,24.2 17.45,24.32 17.95,24.32 17.95,24.2
  cutout Bottom (isolate 0.152): 20.2,24.45 20.07,24.45 20.07,24.95 20.2,24.95
  cutout Bottom (isolate 0.152): 22.95,24.2 22.95,24.07 22.45,24.07 22.45,24.2
  cutout Bottom (isolate 0.152): 23.07,23.95 23.2,23.95 23.2,23.45 23.07,23.45
  cutout Bottom (isolate 0.152): 22.95,25.32 22.95,25.2 22.45,25.2 22.45,25.32
  cutout Bottom (isolate 0.152): 22.2,25.95 22.32,25.95 22.32,25.45 22.2,25.45
  cutout Bottom (isolate 0.152): 19.95,27.2 19.95,27.07 19.45,27.07 19.45,27.2
  cutout Bottom (isolate 0.152): 19.95,28.32 19.95,28.2 19.45,28.2 19.45,28.32
  cutout Bottom (isolate 0.152): 20.07,28.95 20.2,28.95 20.2,28.45 20.07,28.45
  cutout Bottom (isolate 0.152): 19.95,29.2 19.95,29.07 19.45,29.07 19.45,29.2
  cutout Bottom (isolate 0.152): 20.95,29.32 20.95,29.2 20.45,29.2 20.45,29.32
  cutout Bottom (isolate 0.152): 27.57,25.95 27.7,25.95 27.7,25.45 27.57,25.45
  cutout Bottom (isolate 0.152): 33.08,25.95 33.2,25.95 33.2,25.45 33.08,25.45
  cutout Top: 28.7,11.7 28.7,12.2 29.2,12.2 29.2,11.7
  cutout Bottom (isolate 0.152): 22.2,23.95 22.32,23.95 22.32,23.45 22.2,23.45
  cutout Bottom (isolate 0.152): 19.45,24.2 19.45,24.32 19.95,24.32 19.95,24.2
  cutout Bottom (isolate 0.152): 21.2,29.45 21.07,29.45 21.07,29.95 21.2,29.95
  cutout Bottom (isolate 0.152): 20.32,29.45 20.2,29.45 20.2,29.95 20.32,29.95
  cutout Bottom (isolate 0.152): 23.07,25.95 23.2,25.95 23.2,25.45 23.07,25.45
  cutout Bottom (isolate 0.152): 17.45,25.07 17.45,25.2 17.95,25.2 17.95,25.07
  cutout Bottom (isolate 0.152): 20.2,26.45 20.07,26.45 20.07,26.95 20.2,26.95
  pour Route14: 35.08,10.7 33.45,10.7 33.2,10.45 33.2,10.07 33.45,9.82 35.08,9.82 35.33,10.07 35.33,10.45
  pour Route14: 35.08,2.08 33.45,2.08 33.2,1.82 33.2,1.45 33.45,1.2 35.08,1.2 35.33,1.45 35.33,1.82
  pour Route14: 39.08,2.08 37.83,2.08 37.58,1.82 37.58,1.45 37.83,1.2 39.08,1.2 39.33,1.45 39.33,1.82
  pour Route14: 39.08,10.7 37.83,10.7 37.58,10.45 37.58,10.07 37.83,9.82 39.08,9.82 39.33,10.07 39.33,10.45
INIT_B  (via drill 0.35)
  Top 0.127: v33.7,16.45 R15.1
  Route15 0.127: IC1.K10 22.2,24.2 22.2,23.45 22.45,23.2 22.95,23.2 23.45,22.7 23.95,22.7 24.45,23.2 24.95,23.2 25.45,22.7 26.2,22.7 27.45,22.7 31.95,22.7 34.2,20.45 34.2,16.95 v33.7,16.45
  other vias: 21.7,24.7
IO0_14  (via drill 0.35)
  Bottom 0.127: IC1.K12 24.2,25.2 27.7,25.2 30.7,28.2 CON2.35
  other vias: 23.7,24.7
IO2N_14  (via drill 0.35)
  Top 0.127: IC1.K16 35,24.7 v37.7,27.4
  Bottom 0.127: CON2.34 v37.7,27.4
IO2N_34  (via drill 0.35)
  Top 0.127: v5.45,21.8 6.35,22.7 IC1.M1
  Bottom 0.127: CON1.42 v5.45,21.8
IO2N_35  (via drill 0.35)
  Bottom 0.127: IC1.B5 16.7,34.45 16.2,34.95 10.2,34.95 9.95,34.7 8.5,34.7 CON1.9
  other vias: 16.7,32.7
IO2P_14  (via drill 0.35)
  Top 0.127: IC1.K15 27.2,25.2 34.7,25.2 v37.7,28.2
  Bottom 0.127: CON2.36 v37.7,28.2
IO2P_34  (via drill 0.35)
  Top 0.127: IC1.M2 13.2,22.2 6.65,22.2 v5.45,21
  Bottom 0.127: CON1.44 v5.45,21
IO2P_35  (via drill 0.35)
  Bottom 0.127: IC1.B6 17.2,33.2 17.2,34.7 16.5,35.4 CON1.7
  other vias: 17.7,32.7
IO3N_35  (via drill 0.35)
  Top 0.127: IC1.A4 15.7,34.7 13.7,36.7 11.2,36.7 5.95,36.7 v5.45,36.2
  Bottom 0.127: v5.45,36.2 CON1.6
IO3P_35  (via drill 0.35)
  Top 0.127: IC1.A5 16.2,34.2 16.2,34.95 15.57,35.58 13.95,37.2 10.95,37.2 5.65,37.2 v5.45,37
  Bottom 0.127: v5.45,37 CON1.4
IO4N_14  (via drill 0.35)
  Top 0.127: IC1.M14 26.2,23.2 29.2,23.2 29.7,23.7 35.2,23.7 35.6,23.7 37.7,25.8 v38.45,25.8
  Bottom 0.127: CON2.30 v38.45,25.8
IO4N_34  (via drill 0.35)
  Top 0.127: v6.2,19.4 7.5,20.7 IC1.P1
  Bottom 0.127: CON1.48 v6.2,19.4
IO4N_35  (via drill 0.35)
  Bottom 0.127: IC1.A3 13.7,32.7 11.45,32.7 10.45,33.7 8.5,33.7 CON1.11
  other vias: 14.7,33.7
IO4P_14  (via drill 0.35)
  Top 0.127: IC1.L14 26.2,24.2 34.95,24.2 35.3,24.2 37.7,26.6 v38.45,26.6
  Bottom 0.127: CON2.32 v38.45,26.6
IO4P_34  (via drill 0.35)
  Top 0.127: IC1.N1 12.2,21.2 7.2,21.2 v6.2,20.2
  Bottom 0.127: CON1.46 v6.2,20.2
IO4P_35  (via drill 0.35)
  Bottom 0.127: IC1.B4 15.2,32.2 12.2,32.2 | 12.2,32.2 11.95,32.2 | 11.95,32.2 12.2,32.2 | 11.95,32.2 11.2,32.2 10.45,32.95 8.45,32.95 CON1.13
  other vias: 15.7,32.7
IO5N_34  (via drill 0.35)
  Bottom 0.127: IC1.P3 14.2,21.2 9.45,21.2 9.35,21.2 9.15,21 CON1.43
  other vias: 14.7,20.7
IO5N_35  (via drill 0.35)
  Bottom 0.127: IC1.C6 18.2,32.2 18.2,34.45 16.45,36.2 13.45,36.2 13.2,36.2 11.45,36.2 CON1.5
  other vias: 17.7,31.7
IO5P_14  (via drill 0.35)
  Bottom 0.127: IC1.K13 25.2,24.2 26.7,24.2 27.2,24.7 27.95,24.7 30.7,27.45 31.95,27.45 CON2.33
  other vias: 24.7,24.7
IO5P_34  (via drill 0.35)
  Bottom 0.127: IC1.P4 14.7,21.7 8.5,21.7 CON1.41
  other vias: 15.7,20.7
IO5P_35  (via drill 0.35)
  Bottom 0.127: IC1.C7 18.7,34.7 16.7,36.7 11.7,36.7 9.45,36.7 9.15,37 CON1.3
  other vias: 18.7,31.7
IO7N_14  (via drill 0.35)
  Top 0.127: IC1.N16 28.2,22.2 28.45,22.2 35.7,22.2 v37.7,24.2
  Bottom 0.127: CON2.26 v37.7,24.2
IO7N_34  (via drill 0.35)
  Top 0.127: v5.45,18.6 6.45,18.6 7.55,19.7 IC1.R1
  Bottom 0.127: CON1.50 v5.45,18.6
IO7N_35  (via drill 0.35)
  Bottom 0.127: IC1.C2 10.7,31.7 10.2,32.2 CON1.15
  other vias: 13.7,31.7
IO7P_14  (via drill 0.35)
  Top 0.127: v37.7,25 35.4,22.7 IC1.M16
  Bottom 0.127: CON2.28 v37.7,25
IO7P_34  (via drill 0.35)
  Top 0.127: IC1.R2 13.2,19.2 7.85,19.2 6.45,17.8 v5.45,17.8
  Bottom 0.127: CON1.52 v5.45,17.8
IO7P_35  (via drill 0.35)
  Bottom 0.127: IC1.C3 14.2,31.2 11.2,31.2 10.45,31.2 10.2,31.45 8.45,31.45 CON1.17
  other vias: 14.7,31.7
IO8N_14  (via drill 0.35)
  Top 0.127: IC1.P16 29.2,20.7 35.8,20.7 37.7,22.6 v38.45,22.6
  Bottom 0.127: CON2.22 v38.45,22.6
IO8N_15  (via drill 0.35)
  Bottom 0.127: IC1.B14 25.7,34.45 28.2,36.95 31.95,36.95 CON2.57
  other vias: 25.7,32.7
IO8N_34  (via drill 0.35)
  Bottom 0.127: IC1.T2 12.95,19.45 9.2,19.45 9.15,19.4 CON1.47
  other vias: 13.7,18.7
IO8N_35  (via drill 0.35)
  Top 0.127: IC1.A2 13.7,35.45 12.95,36.2 11.2,36.2 7,36.2 v6.2,35.4
  Bottom 0.127: CON1.8 v6.2,35.4
IO8P_14  (via drill 0.35)
  Top 0.127: IC1.P15 27.2,21.2 35.5,21.2 37.7,23.4 v38.45,23.4
  Bottom 0.127: CON2.24 v38.45,23.4
IO8P_15  (via drill 0.35)
  Bottom 0.127: IC1.C14 26.2,32.2 26.2,34.2 28.2,36.2 CON2.55
  other vias: 25.7,31.7
IO8P_34  (via drill 0.35)
  Bottom 0.127: IC1.R3 14.45,19.95 11.2,19.95 9.4,19.95 9.15,20.2 CON1.45
  other vias: 14.7,19.7
IO8P_35  (via drill 0.35)
  Top 0.127: IC1.B2 13.2,33.2 13.2,35.2 12.7,35.7 7.3,35.7 v6.2,34.6
  Bottom 0.127: v6.2,34.6 CON1.10
IO9N_14  (via drill 0.35)
  Bottom 0.127: IC1.R16 29.2,21.2 29.2,22.95 30.45,24.2 CON2.25
  other vias: 27.7,19.7
IO9N_15  (via drill 0.35)
  Top 0.127: v34.95,37 34.65,36.7 27.7,36.7 26.7,35.7 IC1.A15
  Bottom 0.127: CON2.58 v34.95,37
IO9N_34  (via drill 0.35)
  Bottom 0.127: IC1.T3 13.95,17.95 11.2,17.95 9.95,17.95 9.3,18.6 CON1.49
  other vias: 14.7,18.7
IO9N_35  (via drill 0.35)
  Top 0.127: IC1.B1 12.2,32.2 7.8,32.2 6.2,33.8 v5.45,33.8
  Bottom 0.127: v5.45,33.8 CON1.12
IO9P_14  (via drill 0.35)
  Bottom 0.127: IC1.R15 26.95,19.7 28.7,21.45 28.7,23.2 30.45,24.95 31.95,24.95 CON2.27
  other vias: 26.7,19.7
IO9P_15  (via drill 0.35)
  Top 0.127: IC1.B15 27.2,33.2 27.2,35.45 27.95,36.2 v34.95,36.2
  Bottom 0.127: v34.95,36.2 CON2.56
IO9P_34  (via drill 0.35)
  Bottom 0.127: IC1.T4 14.45,17.45 10.7,17.45 9.5,17.45 9.15,17.8 CON1.51
  other vias: 15.7,18.7
IO9P_35  (via drill 0.35)
  Top 0.127: v5.45,32.95 6.2,32.95 7.45,31.7 IC1.C1
  Bottom 0.127: v5.45,32.95 4.05,32.95 CON1.14
IO10N_15  (via drill 0.35)
  Top 0.127: v34.2,35.4 33.45,35.4 30.75,32.7 IC1.B16
  Bottom 0.127: CON2.54 v34.2,35.4
IO10N_35  (via drill 0.35)
  Top 0.127: v6.2,32.2 7.7,30.7 IC1.D1
  Bottom 0.127: v6.2,32.2 CON1.16
IO10P_15  (via drill 0.35)
  Top 0.127: IC1.C16 28.2,32.2 31.05,32.2 33.45,34.6 v34.2,34.6
  Bottom 0.127: CON2.52 v34.2,34.6
IO10P_35  (via drill 0.35)
  Top 0.127: IC1.E2 13.2,30.2 7.4,30.2 v6.2,31.4
  Bottom 0.127: v6.2,31.4 CON1.18
IO11N_14  (via drill 0.35)
  Bottom 0.127: IC1.P13 24.7,17.95 25.07,17.57 28.32,17.57 30.2,19.45 30.2,22.2 30.7,22.7 31.9,22.7 CON2.21
  other vias: 24.7,20.7
IO11P_14  (via drill 0.35)
  Bottom 0.127: IC1.N13 25.2,21.2 25.2,18.2 25.45,17.95 27.95,17.95 29.7,19.7 29.7,22.45 30.7,23.45 31.95,23.45 CON2.23
  other vias: 24.7,21.7
IO12N_14  (via drill 0.35)
  Bottom 0.127: IC1.P14 26.2,21.2 26.2,21.95 26.45,22.2 26.95,22.2 30.45,25.7 31.9,25.7 CON2.29
  other vias: 25.7,20.7
IO12N_35  (via drill 0.35)
  Bottom 0.127: IC1.C4 15.45,31.7 13.95,30.2 12.95,30.2 9.7,30.2 9.2,30.7 8.5,30.7 CON1.19
  other vias: 15.7,31.7
IO12P_14  (via drill 0.35)
  Bottom 0.127: IC1.N14 25.7,22.2 26.2,22.7 26.7,22.7 27.2,23.2 27.2,23.95 27.45,24.2 28.2,24.2 30.45,26.45 31.2,26.45 31.35,26.6 CON2.31
  other vias: 25.7,21.7
IO12P_35  (via drill 0.35)
  Bottom 0.127: IC1.D4 15.2,30.7 14.2,29.7 13.45,29.7 8.5,29.7 CON1.21
  other vias: 15.7,30.7
IO13N_15  (via drill 0.35)
  Bottom 0.127: IC1.E13 25.2,30.2 27.45,30.2 30.95,33.7 31.9,33.7 CON2.49
  other vias: 24.7,29.7
IO13P_15  (via drill 0.35)
  Bottom 0.127: IC1.E12 24.2,29.2 25.95,29.2 26.45,29.7 27.7,29.7 28.57,30.57 | 28.57,30.57 28.7,30.7 | 28.57,30.57 28.7,30.7 | 28.7,30.7 28.95,30.95 30.95,32.95 31.95,32.95 CON2.47
  other vias: 23.7,29.7
IO14N_35  (via drill 0.35)
  Bottom 0.127: IC1.F3 13.7,28.7 13.2,28.2 11.45,28.2 10.7,28.95 8.45,28.95 CON1.23
  other vias: 14.7,28.7
IO14P_35  (via drill 0.35)
  Bottom 0.127: IC1.F4 15.2,28.2 14.2,28.2 13.7,27.7 11.2,27.7 10.7,28.2 CON1.25
  other vias: 15.7,28.7
IO15N_15  (via drill 0.35)
  Bottom 0.127: IC1.D15 27.2,30.7 31.2,34.7 31.3,34.6 CON2.51
  other vias: 26.7,30.7
IO15N_35  (via drill 0.35)
  Top 0.127: v5.45,30.6 6.2,30.6 7.1,29.7 IC1.E1
  Bottom 0.127: v5.45,30.6 CON1.20
IO15P_15  (via drill 0.35)
  Bottom 0.127: IC1.D14 26.2,31.2 26.95,31.2 31.2,35.45 31.25,35.4 CON2.53
  other vias: 25.7,30.7
IO15P_35  (via drill 0.35)
  Top 0.127: IC1.F2 13.2,29.2 6.8,29.2 6.2,29.8 v5.45,29.8
  Bottom 0.127: v5.45,29.8 CON1.22
IO17N_15  (via drill 0.35)
  Top 0.127: v34.95,33.8 33.45,33.8 30.35,30.7 28.7,30.7 IC1.D16
  Bottom 0.127: CON2.50 v34.95,33.8
IO17N_35  (via drill 0.35)
  Top 0.127: v6.2,29 7.5,27.7 IC1.G1
  Bottom 0.127: v6.2,29 CON1.24
IO17P_15  (via drill 0.35)
  Top 0.127: IC1.E16 28.2,30.2 30.65,30.2 33.45,33 v34.95,33
  Bottom 0.127: CON2.48 v34.95,33
IO17P_35  (via drill 0.35)
  Top 0.127: IC1.G2 13.2,27.2 7.2,27.2 v6.2,28.2
  Bottom 0.127: v6.2,28.2 CON1.26
IO19N_35  (via drill 0.35)
  Bottom 0.127: IC1.J4 16.2,25.2 16.2,24.2 15.7,23.7 13.7,23.7 13.2,23.2 10.95,23.2 9.95,24.2 CON1.35
  other vias: 15.7,25.7
IO19P_35  (via drill 0.35)
  Bottom 0.127: IC1.J5 16.7,23.95 15.95,23.2 14.2,23.2 13.7,22.7 12.2,22.7 10.7,22.7 9.95,23.45 8.45,23.45 CON1.37
  other vias: 16.7,25.7
IO20N_35  (via drill 0.35)
  Top 0.127: v5.45,27.4 6.2,27.4 6.9,26.7 IC1.H1
  Bottom 0.127: v5.45,27.4 CON1.28
IO20P_35  (via drill 0.35)
  Top 0.127: IC1.H2 13.2,26.2 6.6,26.2 6.2,26.6 v5.45,26.6
  Bottom 0.127: v5.45,26.6 CON1.30
IO21N_15  (via drill 0.35)
  Bottom 0.127: IC1.F14 26.7,28.7 27.2,29.2 28.7,29.2 28.95,29.45 28.95,30.2 30.95,32.2 CON2.45
  other vias: 25.7,28.7
IO21N_35  (via drill 0.35)
  Bottom 0.127: CON1.27 9.25,27.4 9.45,27.2 10.7,27.2 11.2,26.7 IC1.H3
  other vias: 14.7,26.7
IO21P_15  (via drill 0.35)
  Bottom 0.127: IC1.G14 26.2,28.2 26.7,28.2 | 26.7,28.2 26.95,28.2 | 26.95,28.2 26.7,28.2 | 26.95,28.2 28.45,28.2 29.45,29.2 29.45,29.95 30.95,31.45 31.95,31.45 CON2.43
  other vias: 25.7,27.7
IO21P_35  (via drill 0.35)
  Bottom 0.127: IC1.J3 14.2,26.2 11.95,26.2 10.95,26.2 10.45,26.7 8.5,26.7 CON1.29
  other vias: 14.7,25.7
IO22N_15  (via drill 0.35)
  Top 0.127: IC1.G16 28.95,27.7 33.45,32.2 v34.2,32.2
  Bottom 0.127: CON2.46 v34.2,32.2
IO22N_35  (via drill 0.35)
  Top 0.127: IC1.J1 12.2,25.2 6.8,25.2 v6.2,25.8
  Bottom 0.127: v6.2,25.8 CON1.32
IO22P_15  (via drill 0.35)
  Top 0.127: IC1.H16 28.2,27.2 29.25,27.2 33.45,31.4 v34.2,31.4
  Bottom 0.127: CON2.44 v34.2,31.4
IO22P_35  (via drill 0.35)
  Top 0.127: IC1.K1 10.7,24.7 6.5,24.7 v6.2,25
  Bottom 0.127: CON1.34 v6.2,25
IO23N_15  (via drill 0.35)
  Top 0.127: IC1.J16 29.35,25.7 33.45,29.8 v34.95,29.8
  Bottom 0.127: CON2.40 v34.95,29.8
IO23N_35  (via drill 0.35)
  Top 0.127: IC1.L2 13.2,23.2 5.65,23.2 v5.45,23.4
  Bottom 0.127: CON1.38 v5.45,23.4
IO23P_15  (via drill 0.35)
  Top 0.127: IC1.J15 27.2,26.2 29.05,26.2 33.45,30.6 v34.95,30.6
  Bottom 0.127: CON2.42 v34.95,30.6
IO23P_35  (via drill 0.35)
  Top 0.127: IC1.L3 14.2,24.2 12.2,24.2 11.7,23.7 5.95,23.7 v5.45,24.2
  Bottom 0.127: v5.45,24.2 CON1.36
IO24N_15  (via drill 0.35)
  Bottom 0.127: IC1.G15 28.7,27.7 29.95,28.95 29.95,29.7 30.7,30.45 31.85,30.45 CON2.41
  other vias: 26.7,27.7
IO24N_35  (via drill 0.35)
  Bottom 0.127: IC1.K2 10.95,24.7 9.95,25.7 8.5,25.7 CON1.31
  other vias: 13.7,24.7
IO24P_15  (via drill 0.35)
  Bottom 0.127: IC1.H14 26.2,27.2 28.95,27.2 30.45,28.7 30.45,29.45 30.7,29.7 31.7,29.7 | 31.7,29.7 31.9,29.7 | CON2.39 31.9,29.7 | 31.9,29.7 31.7,29.7
  other vias: 25.7,26.7
IO24P_35  (via drill 0.35)
  Bottom 0.127: IC1.K3 14.2,24.2 10.7,24.2 9.95,24.95 8.45,24.95 CON1.33
  other vias: 14.7,24.7
JTAG_TCK  (via drill 0.35)
  Top 0.127: IC8.32 16.25,12.95 v15.2,12.95 TP3.1
  Route15 0.127: IC1.L7 17.2,22.2 17.2,19.7 16.45,18.95 16.45,17.95 15.45,16.95 15.45,13.2 v15.2,12.95
  Bottom 0.127: v15.2,12.95 R6.2
  other vias: 18.7,23.7
JTAG_TDI  (via drill 0.35)
  Top 0.127: IC8.33 v16.45,12.45 14.35,12.45 R5.1 14.1,13.8 TP2.1
  Route15 0.127: IC1.N7 18.2,21.2 18.2,18.2 16.45,16.45 v16.45,12.45
  other vias: 18.7,21.7
JTAG_TDO  (via drill 0.35)
  Top 0.127: IC8.34 v15.7,11.95 | v16.95,16.2 16.45,15.7 TP4.1
  Route15 0.127: IC1.N8 19.2,21.2 19.2,18.57 16.95,16.32 v16.95,16.2 16.95,12.2 16.7,11.95 v15.7,11.95
  other vias: 19.7,21.7
JTAG_TMS  (via drill 0.35)
  Top 0.127: IC8.35 v16.45,11.45 14.85,11.45 R7.1 14.1,10.8 13.2,11.7 13.2,13.2 12.95,13.45 12.95,14.95 TP1.1
  Route15 0.127: IC1.M7 17.7,21.7 17.7,19.45 17.2,18.95 17.2,17.95 15.95,16.7 15.95,13.7 15.95,12.95 15.2,12.2 15.2,11.7 15.45,11.45 v16.45,11.45
  other vias: 18.7,22.7
LED0
  Top 0.127: IC1.R7 18.2,19.2 18.2,17.95 16.95,16.7 12.7,16.7 12.2,16.2 10.67,16.2 10.07,15.6 D1.A
LED1
  Top 0.127: IC1.R6 17.2,19.2 17.2,17.7 16.57,17.07 12.57,17.07 12.07,16.57 9.32,16.57 8.35,15.6 D2.A
LED2
  Top 0.127: IC1.T5 16.7,17.95 16.2,17.45 12.45,17.45 11.95,17.95 10.57,17.95 9.82,17.2 9.32,17.2 8.47,16.35 7.33,16.35 6.58,15.6 D3.A
LED3
  Top 0.127: IC1.R5 16.2,19.2 16.2,18.2 15.82,17.82 12.57,17.82 12.07,18.32 10.45,18.32 9.82,17.7 9.2,17.7 8.2,16.7 5.92,16.7 4.83,15.6 D4.A
N$1
  Top 0.127: D5.K 2.95,13.05 2,12.1 R18.2
N$2
  Top 0.127: R8.2 10.4,12.1 9.95,12.55 D1.K
N$3
  Top 0.127: D2.K 8.2,12.55 8.65,12.1 R9.2
N$4
  Top 0.127: D3.K 6.48,13.8 7.45,12.82 7.45,10.8 R10.2
N$5
  Top 0.127: D4.K 4.7,13.05 3.75,12.1 R14.2
N$6  (via drill 0.35)
  Top 0.127: CON3.A5:CC1 v34.2,4.7
  Bottom 0.127: v34.2,4.7 34.08,4.7 33.2,3.83 31.7,3.83 31.51,3.64 31.51,2.14 31.2,1.82 29.57,1.82 28.82,2.58 28.82,3.58 28.57,3.83 28.07,3.83 27.35,4.55 R12.2
N$7  (via drill 0.35)
  Top 0.127: CON3.B5:CC2 v34.2,7.7
  Bottom 0.127: R13.2 29.1,4.55 29.2,4.45 29.2,2.83 29.82,2.2 30.95,2.2 31.14,2.39 31.14,3.89 31.45,4.2 32.95,4.2 34.2,5.45 v34.2,7.7
N$8
  Bottom 0.127: J3.1 25.82,15.07 X1.3
N$9
  Top 0.127: IC8.56 24.95,3.45 25.2,3.2 25.8,3.2 IC7.4
N$10
  Top 0.127: R16.2 21.75,3 IC7.3 23.6,3.2 24.2,3.2 24.45,3.45 IC8.55
N$11
  Top 0.127: IC8.1 26.45,7.95 26.95,7.45 26.95,4.45 26.45,3.95 IC7.5
N$12
  Top 0.127: IC7.1 21.75,4.9 R16.1 21.6,4.85 20.95,4.2 20.95,3.7 20.3,3.05 R11.2
N$13
  Top 0.127: IC8.4 27.2,9.45 27.95,8.7 28.3,8.35 C56.1 28.3,8.1 28.95,7.45 29.45,7.45 30.32,6.58 X2.3
N$14
  Top 0.127: IC8.3 26.95,8.95 27.45,8.45 27.45,5.7 28.32,4.83 X2.1 28.3,4.78 C55.1
N$15
  Top 0.127: IC8.6 27.8,10.45 R20.1
N$16
  Top 0.127: R21.2 28.05,12.95 IC8.11
PROGRAM_B  (via drill 0.35)
  Top 0.127: v33.7,18.2 R17.1
  Route15 0.127: IC1.L9 21.2,23.2 21.95,23.2 22.2,22.95 22.2,22.45 22.45,22.2 31.7,22.2 33.7,20.2 v33.7,18.2
  other vias: 20.7,23.7
USB_+5V  (via drill 0.35, 0.5)
  Top 0.406: CON3.B4,A9:VBUS v33.65,8.35 | CON3.A4,B9:VBUS v33.65,3.55
  Route3 0.61: v28.45,2.2 32.3,2.2 33.4,3.3 CON3.A4,B9:VBUS | v33.65,3.55 CON3.A4,B9:VBUS | CON3.A4,B9:VBUS 33.4,8.1 v33.65,8.35
  Bottom 0.406: FB1.1 v28.45,2.2
USB_DM
  Top 0.152: IC8.7 30.7,10.95 31.7,9.95 31.7,6.83 32.33,6.2 | 32.33,6.2 CON3.A7:DN1 | CON3.B7:DN2 32.58,5.2 32.33,5.45 32.33,6.2
USB_DP
  Top 0.152: IC8.8 30.95,11.45 32.2,10.2 32.2,7.08 32.58,6.7 CON3.B6:DP2 34.2,6.7 34.45,6.45 34.45,5.95 34.2,5.7 CON3.A6:DP1
VCCO34  (via drill 0.35, 0.5)
  Top 0.406: J1.2 2.7,19.45 2.7,19.95 2.08,20.57 2.08,21.57 C25.1 v1.95,22.95
  Bottom 0.203: IC1.M3 C35.1
  Bottom 0.406: IC1.T1 C31.1 | IC1.R4 16.07,19.7 16.68,19.1 C29.1
  other vias: 14.7,22.7 15.7,19.7 12.7,18.7
  pour Route3 (isolate 0.152): 16.2,23.2 0.7,23.2 0.7,19.2 10.2,19.2 11.2,18.2 16.2,18.2
VCCO35  (via drill 0.35, 0.5)
  Top 0.406: v1.95,27.95 C26.1 1.95,26.45 2.95,25.45 J2.2
  Bottom 0.406: C30.1 IC1.E4 | IC1.B3 15.45,33.45 C36.1
  other vias: 17.7,33.7 14.7,32.7 12.7,28.7 18.7,30.7 15.7,29.7 13.7,25.7
  pour Route3 (isolate 0.152): 16.2,24.45 0.7,24.45 0.7,29.2 10.95,29.2 12.2,30.45 12.2,34.2 18.95,34.2 18.95,30.2 16.2,30.2
VIN  (via drill 0.35, 0.5)
  Top 0.406: v17.2,1.7 FB2.1
  Route3 0.61: v24.95,2.2 27.07,2.2 27.95,3.08 31.2,3.08 32.58,4.45 32.58,8.82 31.2,10.2 31.2,13.85 v30.45,14.6 v30.45,15.4
  Bottom 0.406: v17.2,1.7 17.7,2.2 23.7,2.2 | 23.7,2.2 v24.95,2.2 FB1.2 | C1.1 23.7,2.2 | CON2.3 v30.45,15.4 | CON2.3 CON2.1 30.47,14.6 v30.45,14.6 | CON2.2 CON2.4 CON2.3
VIN_DCDC  (via drill 0.5)
  Top 0.254: IC4.1 5.95,2.08 5.83,1.95 3.85,1.95 C7.1 3.55,1.95 v2.7,1.95 | IC5.5 v15.7,3.7 | IC4.5 v9.2,3.7 | v9.7,1.45 10.22,1.45 10.57,1.8 C10.1 10.95,2.05 12.8,2.05 12.95,2.2 IC5.1
  Top 0.406: FB2.2 16.95,4.2 16.2,4.2 v15.7,3.7
  Route15 0.61: v2.7,1.95 3.2,1.45 v9.7,1.45 | v9.2,3.7 9.7,3.2 v9.7,1.45 | v9.7,1.45 13.45,1.45 v15.7,3.7
  Bottom 0.254: v9.2,3.7 9.2,4.98 8.72,5.45 8.07,5.45 | C4.1 v15.7,3.7 15.7,4.45 14.7,5.45 14.2,5.45 | 8.07,5.45 6.45,5.45 6.25,5.65 IC3.1 6.25,8.15 C16.1 | IC3.3 8.15,5.7 8.15,5.53 8.07,5.45 | 14.2,5.45 12.45,5.45 12.25,5.65 IC2.1 12.25,8.15 C15.1 | IC2.3 14.15,5.5 14.2,5.45

## Text on the board
tPlace: FPGA Core Board ver3